# Altium schematic sheet CPU_LPDDR4.SchDoc
size C; SheetNumber: 23; SheetTotal: 25
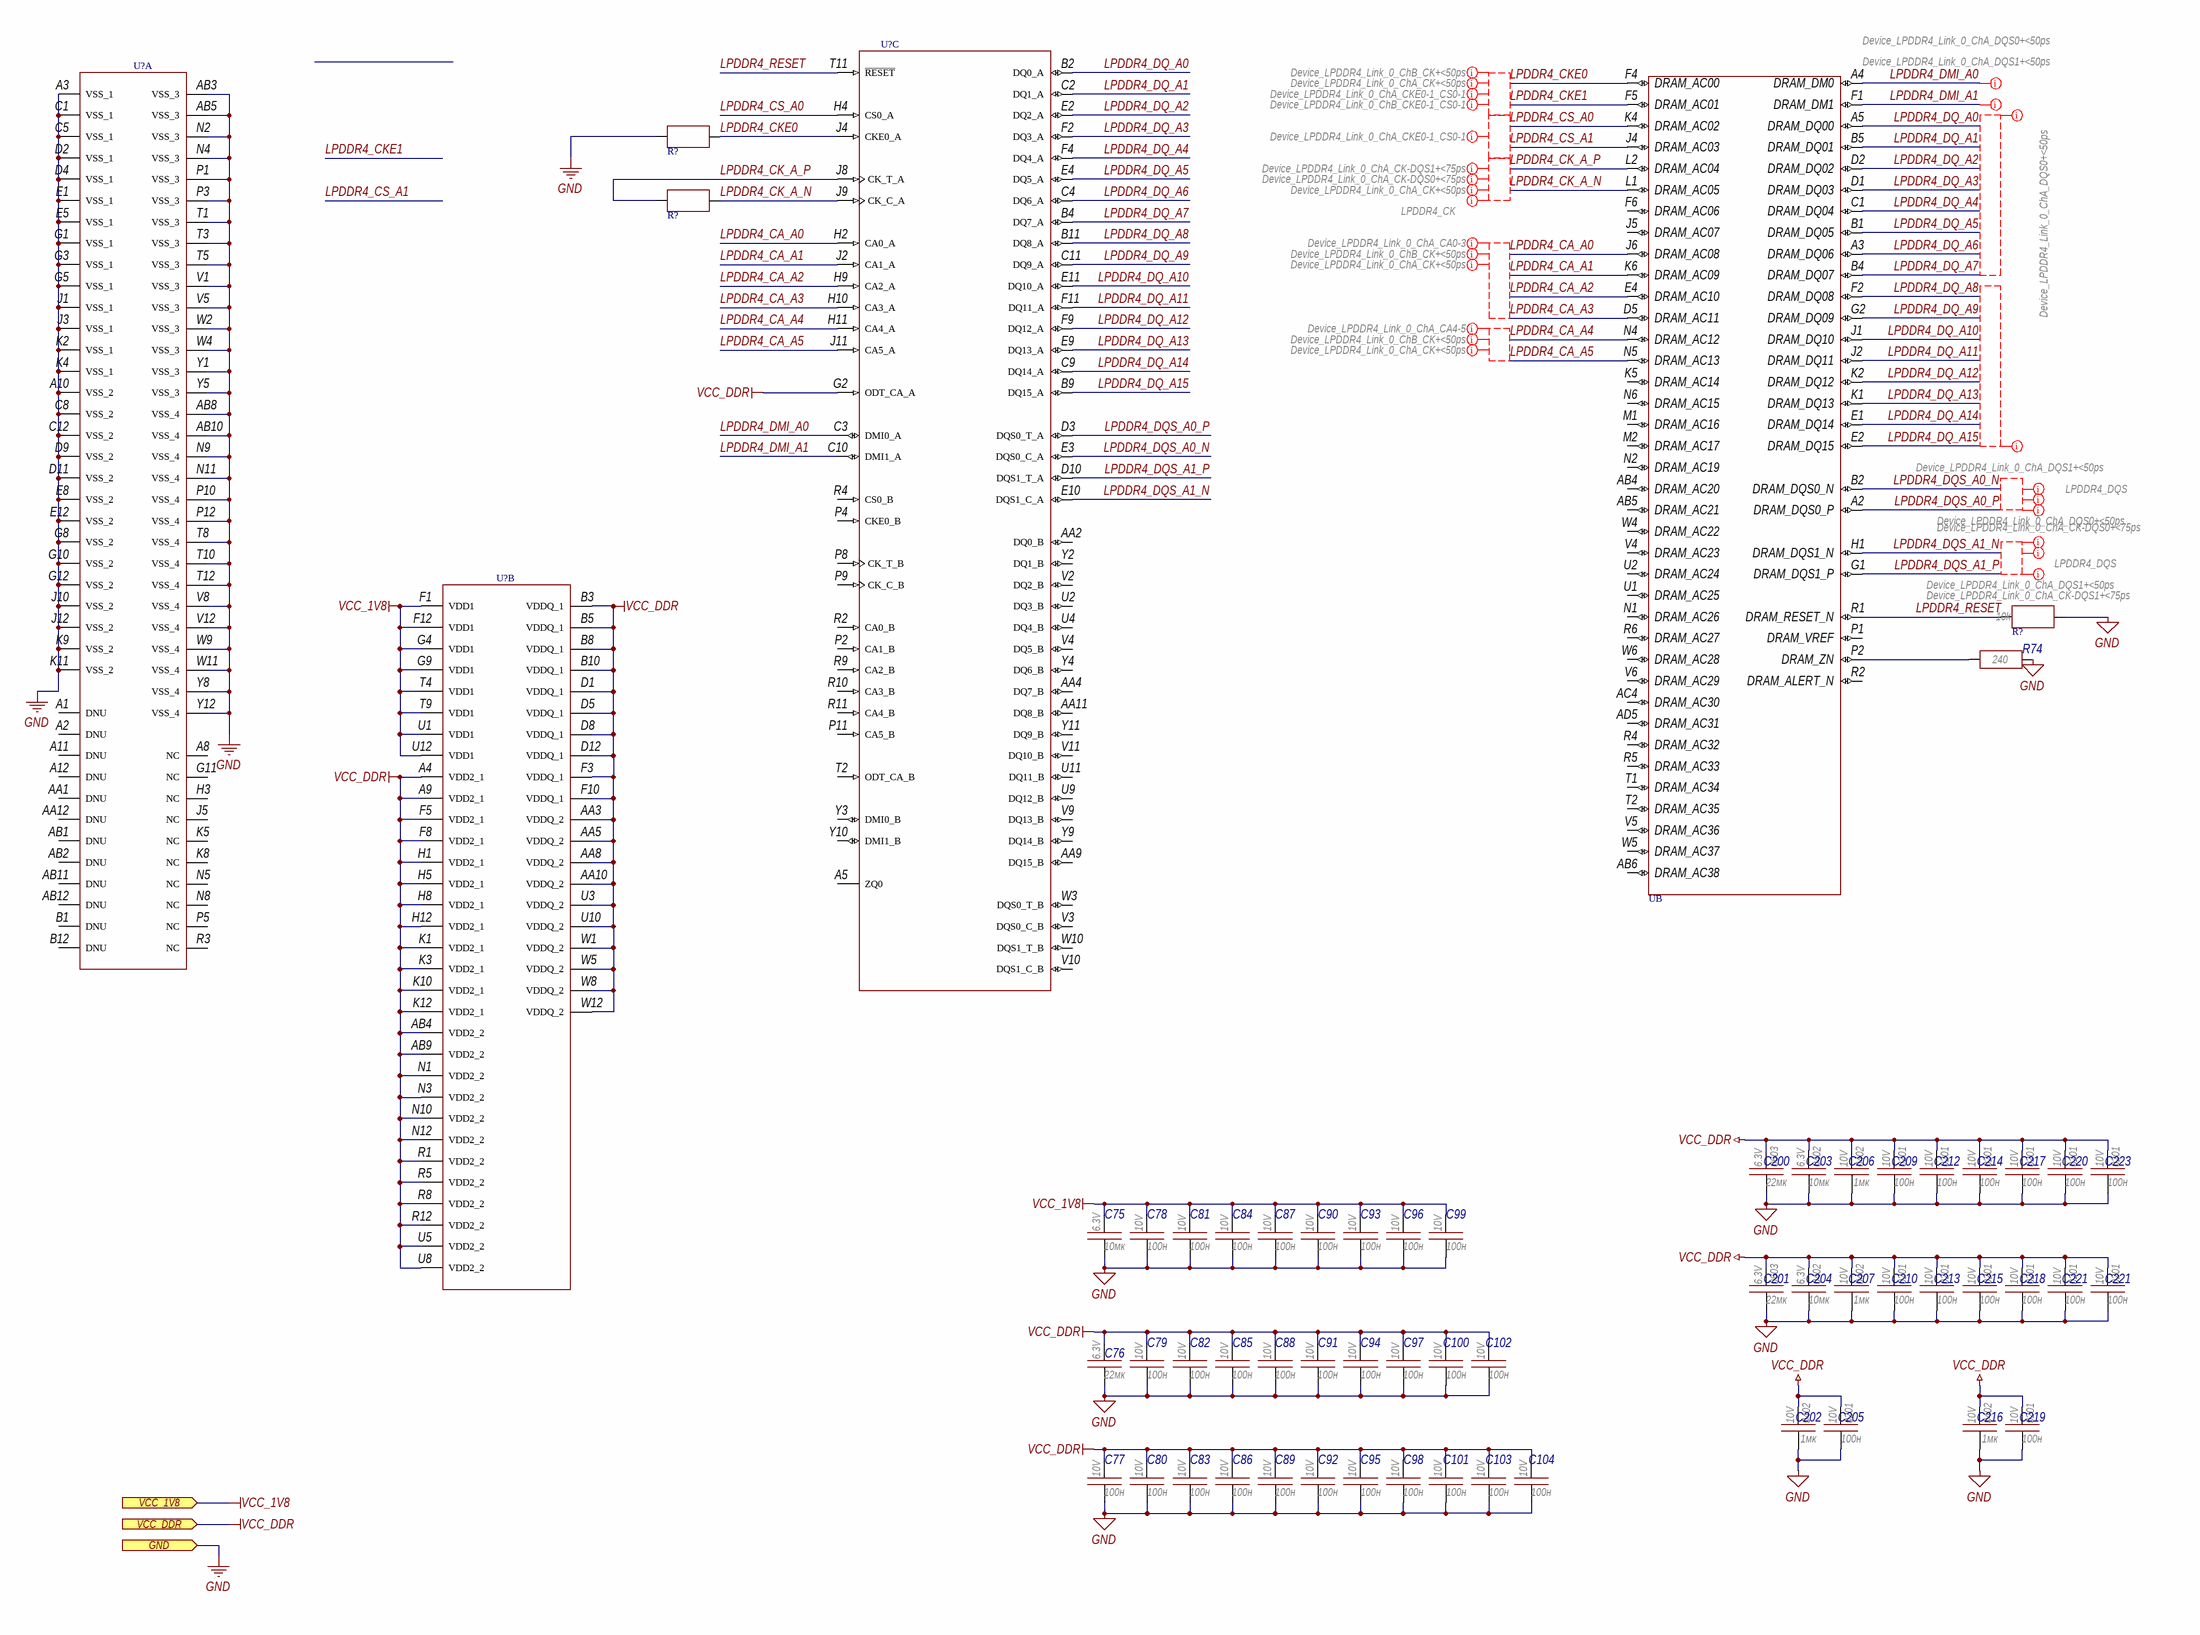
[diagram p0: CPU_LPDDR4.SchDoc]

## Parts
(Parts that share a designator on the sheet are numbered #1, #2 ... from top to bottom, then left to right.)
C75  Значение: 10мк  3) Voltage: 6.3V  [CAPC_1.15x0.65x0.65B_L_Gap-0.25mm]  (hidden comment: GRM155R60J106ME15)
C76  Значение: 22мк  3) Voltage: 6.3V  [CAPC_1.8x1.0x1.0B_L]  (hidden comment: GRM188R60J226MEA0)
C77  Значение: 100н  3) Voltage: 10V  [CAPC_0.63x0.33x0.33B_L_SG-0.25_SE-0.05]  (hidden comment: Capacitor unpolarized)
C78  Значение: 100н  3) Voltage: 10V  [CAPC_0.63x0.33x0.33B_L_SG-0.25_SE-0.05]  (hidden comment: Capacitor unpolarized)
C79  Значение: 100н  3) Voltage: 10V  [CAPC_0.63x0.33x0.33B_L_SG-0.25_SE-0.05]  (hidden comment: Capacitor unpolarized)
C80  Значение: 100н  3) Voltage: 10V  [CAPC_0.63x0.33x0.33B_L_SG-0.25_SE-0.05]  (hidden comment: Capacitor unpolarized)
C81  Значение: 100н  3) Voltage: 10V  [CAPC_0.63x0.33x0.33B_L_SG-0.25_SE-0.05]  (hidden comment: Capacitor unpolarized)
C82  Значение: 100н  3) Voltage: 10V  [CAPC_0.63x0.33x0.33B_L_SG-0.25_SE-0.05]  (hidden comment: Capacitor unpolarized)
C83  Значение: 100н  3) Voltage: 10V  [CAPC_0.63x0.33x0.33B_L_SG-0.25_SE-0.05]  (hidden comment: Capacitor unpolarized)
C84  Значение: 100н  3) Voltage: 10V  [CAPC_0.63x0.33x0.33B_L_SG-0.25_SE-0.05]  (hidden comment: Capacitor unpolarized)
C85  Значение: 100н  3) Voltage: 10V  [CAPC_0.63x0.33x0.33B_L_SG-0.25_SE-0.05]  (hidden comment: Capacitor unpolarized)
C86  Значение: 100н  3) Voltage: 10V  [CAPC_0.63x0.33x0.33B_L_SG-0.25_SE-0.05]  (hidden comment: Capacitor unpolarized)
C87  Значение: 100н  3) Voltage: 10V  [CAPC_0.63x0.33x0.33B_L_SG-0.25_SE-0.05]  (hidden comment: Capacitor unpolarized)
C88  Значение: 100н  3) Voltage: 10V  [CAPC_0.63x0.33x0.33B_L_SG-0.25_SE-0.05]  (hidden comment: Capacitor unpolarized)
C89  Значение: 100н  3) Voltage: 10V  [CAPC_0.63x0.33x0.33B_L_SG-0.25_SE-0.05]  (hidden comment: Capacitor unpolarized)
C90  Значение: 100н  3) Voltage: 10V  [CAPC_0.63x0.33x0.33B_L_SG-0.25_SE-0.05]  (hidden comment: Capacitor unpolarized)
C91  Значение: 100н  3) Voltage: 10V  [CAPC_0.63x0.33x0.33B_L_SG-0.25_SE-0.05]  (hidden comment: Capacitor unpolarized)
C92  Значение: 100н  3) Voltage: 10V  [CAPC_0.63x0.33x0.33B_L_SG-0.25_SE-0.05]  (hidden comment: Capacitor unpolarized)
C93  Значение: 100н  3) Voltage: 10V  [CAPC_0.63x0.33x0.33B_L_SG-0.25_SE-0.05]  (hidden comment: Capacitor unpolarized)
C94  Значение: 100н  3) Voltage: 10V  [CAPC_0.63x0.33x0.33B_L_SG-0.25_SE-0.05]  (hidden comment: Capacitor unpolarized)
C95  Значение: 100н  3) Voltage: 10V  [CAPC_0.63x0.33x0.33B_L_SG-0.25_SE-0.05]  (hidden comment: Capacitor unpolarized)
C96  Значение: 100н  3) Voltage: 10V  [CAPC_0.63x0.33x0.33B_L_SG-0.25_SE-0.05]  (hidden comment: Capacitor unpolarized)
C97  Значение: 100н  3) Voltage: 10V  [CAPC_0.63x0.33x0.33B_L_SG-0.25_SE-0.05]  (hidden comment: Capacitor unpolarized)
C98  Значение: 100н  3) Voltage: 10V  [CAPC_0.63x0.33x0.33B_L_SG-0.25_SE-0.05]  (hidden comment: Capacitor unpolarized)
C99  Значение: 100н  3) Voltage: 10V  [CAPC_0.63x0.33x0.33B_L_SG-0.25_SE-0.05]  (hidden comment: Capacitor unpolarized)
C100  Значение: 100н  3) Voltage: 10V  [CAPC_0.63x0.33x0.33B_L_SG-0.25_SE-0.05]  (hidden comment: Capacitor unpolarized)
C101  Значение: 100н  3) Voltage: 10V  [CAPC_0.63x0.33x0.33B_L_SG-0.25_SE-0.05]  (hidden comment: Capacitor unpolarized)
C102  Значение: 100н  3) Voltage: 10V  [CAPC_0.63x0.33x0.33B_L_SG-0.25_SE-0.05]  (hidden comment: Capacitor unpolarized)
C103  Значение: 100н  3) Voltage: 10V  [CAPC_0.63x0.33x0.33B_L_SG-0.25_SE-0.05]  (hidden comment: Capacitor unpolarized)
C104  Значение: 100н  3) Voltage: 10V  [CAPC_0.63x0.33x0.33B_L_SG-0.25_SE-0.05]  (hidden comment: Capacitor unpolarized)
C200  Значение: 22мк  2) Package: 0603  3) Voltage: 6.3V  [CAPC_1.8x1.0x1.0B_L]  (hidden comment: GRM188R60J226MEA0)
C201  Значение: 22мк  2) Package: 0603  3) Voltage: 6.3V  [CAPC_1.8x1.0x1.0B_L]  (hidden comment: GRM188R60J226MEA0)
C202  Значение: 1мк  2) Package: 0402  3) Voltage: 10V  [CAPC_1.05x0.55x0.55B_N_SG-0.25_SE-0.05]  (hidden comment: GRM155R61A105KE15D)
C203  Значение: 10мк  2) Package: 0402  3) Voltage: 6.3V  [CAPC_1.15x0.65x0.65B_L_Gap-0.25mm]  (hidden comment: GRM155R60J106ME15)
C204  Значение: 10мк  2) Package: 0402  3) Voltage: 6.3V  [CAPC_1.15x0.65x0.65B_L_Gap-0.25mm]  (hidden comment: GRM155R60J106ME15)
C205  Значение: 100н  2) Package: 0201  3) Voltage: 10V  [CAPC_0.63x0.33x0.33B_LL_SG-0.25_SE-0.05]  (hidden comment: GRM033R61A104KE15)
C206  Значение: 1мк  2) Package: 0402  3) Voltage: 10V  [CAPC_1.05x0.55x0.55B_N_SG-0.25_SE-0.05]  (hidden comment: GRM155R61A105KE15D)
C207  Значение: 1мк  2) Package: 0402  3) Voltage: 10V  [CAPC_1.05x0.55x0.55B_N_SG-0.25_SE-0.05]  (hidden comment: GRM155R61A105KE15D)
C209  Значение: 100н  2) Package: 0201  3) Voltage: 10V  [CAPC_0.63x0.33x0.33B_LL_SG-0.25_SE-0.05]  (hidden comment: GRM033R61A104KE15)
C210  Значение: 100н  2) Package: 0201  3) Voltage: 10V  [CAPC_0.63x0.33x0.33B_LL_SG-0.25_SE-0.05]  (hidden comment: GRM033R61A104KE15)
C212  Значение: 100н  2) Package: 0201  3) Voltage: 10V  [CAPC_0.63x0.33x0.33B_LL_SG-0.25_SE-0.05]  (hidden comment: GRM033R61A104KE15)
C213  Значение: 100н  2) Package: 0201  3) Voltage: 10V  [CAPC_0.63x0.33x0.33B_LL_SG-0.25_SE-0.05]  (hidden comment: GRM033R61A104KE15)
C214  Значение: 100н  2) Package: 0201  3) Voltage: 10V  [CAPC_0.63x0.33x0.33B_LL_SG-0.25_SE-0.05]  (hidden comment: GRM033R61A104KE15)
C215  Значение: 100н  2) Package: 0201  3) Voltage: 10V  [CAPC_0.63x0.33x0.33B_LL_SG-0.25_SE-0.05]  (hidden comment: GRM033R61A104KE15)
C216  Значение: 1мк  2) Package: 0402  3) Voltage: 10V  [CAPC_1.05x0.55x0.55B_N_SG-0.25_SE-0.05]  (hidden comment: GRM155R61A105KE15D)
C217  Значение: 100н  2) Package: 0201  3) Voltage: 10V  [CAPC_0.63x0.33x0.33B_LL_SG-0.25_SE-0.05]  (hidden comment: GRM033R61A104KE15)
C218  Значение: 100н  2) Package: 0201  3) Voltage: 10V  [CAPC_0.63x0.33x0.33B_LL_SG-0.25_SE-0.05]  (hidden comment: GRM033R61A104KE15)
C219  Значение: 100н  2) Package: 0201  3) Voltage: 10V  [CAPC_0.63x0.33x0.33B_LL_SG-0.25_SE-0.05]  (hidden comment: GRM033R61A104KE15)
C220  Значение: 100н  2) Package: 0201  3) Voltage: 10V  [CAPC_0.63x0.33x0.33B_LL_SG-0.25_SE-0.05]  (hidden comment: GRM033R61A104KE15)
C221#1  Значение: 100н  2) Package: 0201  3) Voltage: 10V  [CAPC_0.63x0.33x0.33B_LL_SG-0.25_SE-0.05]  (hidden comment: GRM033R61A104KE15)
C221#2  Значение: 100н  2) Package: 0201  3) Voltage: 10V  [CAPC_0.63x0.33x0.33B_LL_SG-0.25_SE-0.05]  (hidden comment: GRM033R61A104KE15)
C223  Значение: 100н  2) Package: 0201  3) Voltage: 10V  [CAPC_0.63x0.33x0.33B_LL_SG-0.25_SE-0.05]  (hidden comment: GRM033R61A104KE15)
R74  Значение: 240  [RESC_1.05x0.55x0.40B_L]  (hidden comment: RC0402FR-07240RL)
R?#1  0R NP  [R0603]  (value not drawn)
R?#2  150R  [R0603]  (value not drawn)
R?#3  10k  [R0603]
U  MIMX8MN6DVTJZAA  [486-BGA-NXP]  (value not drawn)  (part B of 8)
U?#1  MT53E256M32D2DS-046_IT:B  [*IC_MT53E256M32D2DS-046_IT:B_MT53E256M32D2DS-046_IT:B(Primary)]  (value not drawn)  (part C of 3)
U?#2  MT53E256M32D2DS-046_IT:B  [*IC_MT53E256M32D2DS-046_IT:B_MT53E256M32D2DS-046_IT:B(Primary)]  (value not drawn)  (part A of 3)
U?#3  MT53E256M32D2DS-046_IT:B  [*IC_MT53E256M32D2DS-046_IT:B_MT53E256M32D2DS-046_IT:B(Primary)]  (value not drawn)  (part B of 3)

## Ports
GND (in), VCC_1V8 (in), VCC_DDR (in)

## Nets
GND: C75.2 C76.2 C77.2 C78.2 C79.2 C80.2 C81.2 C82.2 C83.2 C84.2 C85.2 C86.2 C87.2 C88.2 C89.2 C90.2 C91.2 C92.2 C93.2 C94.2 C95.2 C96.2 C97.2 C98.2 C99.2 C100.2 C101.2 C102.2 C103.2 C104.2 C200.2 C201.2 C202.2 C203.2 C204.2 C205.2 C206.2 C207.2 C209.2 C210.2 C212.2 C213.2 C214.2 C215.2 C216.2 C217.2 C218.2 C219.2 C220.2 C221#1.2 C221#2.2 C223.2 R74.2 R?#1.1 R?#3.2 U?#2.A3(VSS_1) U?#2.A10(VSS_2) U?#2.AB3(VSS_3) U?#2.AB5(VSS_3) U?#2.AB8(VSS_4) U?#2.AB10(VSS_4) U?#2.C1(VSS_1) U?#2.C5(VSS_1) U?#2.C8(VSS_2) U?#2.C12(VSS_2) U?#2.D2(VSS_1) U?#2.D4(VSS_1) U?#2.D9(VSS_2) U?#2.D11(VSS_2) U?#2.E1(VSS_1) U?#2.E5(VSS_1) U?#2.E8(VSS_2) U?#2.E12(VSS_2) U?#2.G1(VSS_1) U?#2.G3(VSS_1) U?#2.G5(VSS_1) U?#2.G8(VSS_2) U?#2.G10(VSS_2) U?#2.G12(VSS_2) U?#2.J1(VSS_1) U?#2.J3(VSS_1) U?#2.J10(VSS_2) U?#2.J12(VSS_2) U?#2.K2(VSS_1) U?#2.K4(VSS_1) U?#2.K9(VSS_2) U?#2.K11(VSS_2) U?#2.N2(VSS_3) U?#2.N4(VSS_3) U?#2.N9(VSS_4) U?#2.N11(VSS_4) U?#2.P1(VSS_3) U?#2.P3(VSS_3) U?#2.P10(VSS_4) U?#2.P12(VSS_4) U?#2.T1(VSS_3) U?#2.T3(VSS_3) U?#2.T5(VSS_3) U?#2.T8(VSS_4) U?#2.T10(VSS_4) U?#2.T12(VSS_4) U?#2.V1(VSS_3) U?#2.V5(VSS_3) U?#2.V8(VSS_4) U?#2.V12(VSS_4) U?#2.W2(VSS_3) U?#2.W4(VSS_3) U?#2.W9(VSS_4) U?#2.W11(VSS_4) U?#2.Y1(VSS_3) U?#2.Y5(VSS_3) U?#2.Y8(VSS_4) U?#2.Y12(VSS_4) ; port GND
VCC_1V8: C75.1 C78.1 C81.1 C84.1 C87.1 C90.1 C93.1 C96.1 C99.1 U?#3.F1(VDD1) U?#3.F12(VDD1) U?#3.G4(VDD1) U?#3.G9(VDD1) U?#3.T4(VDD1) U?#3.T9(VDD1) U?#3.U1(VDD1) U?#3.U12(VDD1) ; port VCC_1V8
VCC_DDR: C76.1 C77.1 C79.1 C80.1 C82.1 C83.1 C85.1 C86.1 C88.1 C89.1 C91.1 C92.1 C94.1 C95.1 C97.1 C98.1 C100.1 C101.1 C102.1 C103.1 C104.1 C200.1 C201.1 C202.1 C203.1 C204.1 C205.1 C206.1 C207.1 C209.1 C210.1 C212.1 C213.1 C214.1 C215.1 C216.1 C217.1 C218.1 C219.1 C220.1 C221#1.1 C221#2.1 C223.1 U?#1.G2(ODT_CA_A) U?#3.A4(VDD2_1) U?#3.A9(VDD2_1) U?#3.AA3(VDDQ_2) U?#3.AA5(VDDQ_2) U?#3.AA8(VDDQ_2) U?#3.AA10(VDDQ_2) U?#3.AB4(VDD2_2) U?#3.AB9(VDD2_2) U?#3.B3(VDDQ_1) U?#3.B5(VDDQ_1) U?#3.B8(VDDQ_1) U?#3.B10(VDDQ_1) U?#3.D1(VDDQ_1) U?#3.D5(VDDQ_1) U?#3.D8(VDDQ_1) U?#3.D12(VDDQ_1) U?#3.F3(VDDQ_1) U?#3.F5(VDD2_1) U?#3.F8(VDD2_1) U?#3.F10(VDDQ_1) U?#3.H1(VDD2_1) U?#3.H5(VDD2_1) U?#3.H8(VDD2_1) U?#3.H12(VDD2_1) U?#3.K1(VDD2_1) U?#3.K3(VDD2_1) U?#3.K10(VDD2_1) U?#3.K12(VDD2_1) U?#3.N1(VDD2_2) U?#3.N3(VDD2_2) U?#3.N10(VDD2_2) U?#3.N12(VDD2_2) U?#3.R1(VDD2_2) U?#3.R5(VDD2_2) U?#3.R8(VDD2_2) U?#3.R12(VDD2_2) U?#3.U3(VDDQ_2) U?#3.U5(VDD2_2) U?#3.U8(VDD2_2) U?#3.U10(VDDQ_2) U?#3.W1(VDDQ_2) U?#3.W5(VDDQ_2) U?#3.W8(VDDQ_2) U?#3.W12(VDDQ_2) ; port VCC_DDR
LPDDR4_CA_A0: U.J6(DRAM_AC08) U?#1.H2(CA0_A)
LPDDR4_CA_A1: U.K6(DRAM_AC09) U?#1.J2(CA1_A)
LPDDR4_CA_A2: U.E4(DRAM_AC10) U?#1.H9(CA2_A)
LPDDR4_CA_A3: U.D5(DRAM_AC11) U?#1.H10(CA3_A)
LPDDR4_CA_A4: U.N4(DRAM_AC12) U?#1.H11(CA4_A)
LPDDR4_CA_A5: U.N5(DRAM_AC13) U?#1.J11(CA5_A)
LPDDR4_CK_A_N: R?#2.2 U.L1(DRAM_AC05) U?#1.J9(CK_C_A)
LPDDR4_CK_A_P: R?#2.1 U.L2(DRAM_AC04) U?#1.J8(CK_T_A)
LPDDR4_CKE0: R?#1.2 U.F4(DRAM_AC00) U?#1.J4(CKE0_A)
LPDDR4_CKE1: U.F5(DRAM_AC01)
LPDDR4_CS_A0: U.K4(DRAM_AC02) U?#1.H4(CS0_A)
LPDDR4_CS_A1: U.J4(DRAM_AC03)
LPDDR4_DMI_A0: U.A4(DRAM_DM0) U?#1.C3(DMI0_A)
LPDDR4_DMI_A1: U.F1(DRAM_DM1) U?#1.C10(DMI1_A)
LPDDR4_DQ_A0: U.A5(DRAM_DQ00) U?#1.B2(DQ0_A)
LPDDR4_DQ_A1: U.B5(DRAM_DQ01) U?#1.C2(DQ1_A)
LPDDR4_DQ_A2: U.D2(DRAM_DQ02) U?#1.E2(DQ2_A)
LPDDR4_DQ_A3: U.D1(DRAM_DQ03) U?#1.F2(DQ3_A)
LPDDR4_DQ_A4: U.C1(DRAM_DQ04) U?#1.F4(DQ4_A)
LPDDR4_DQ_A5: U.B1(DRAM_DQ05) U?#1.E4(DQ5_A)
LPDDR4_DQ_A6: U.A3(DRAM_DQ06) U?#1.C4(DQ6_A)
LPDDR4_DQ_A7: U.B4(DRAM_DQ07) U?#1.B4(DQ7_A)
LPDDR4_DQ_A8: U.F2(DRAM_DQ08) U?#1.B11(DQ8_A)
LPDDR4_DQ_A9: U.G2(DRAM_DQ09) U?#1.C11(DQ9_A)
LPDDR4_DQ_A10: U.J1(DRAM_DQ10) U?#1.E11(DQ10_A)
LPDDR4_DQ_A11: U.J2(DRAM_DQ11) U?#1.F11(DQ11_A)
LPDDR4_DQ_A12: U.K2(DRAM_DQ12) U?#1.F9(DQ12_A)
LPDDR4_DQ_A13: U.K1(DRAM_DQ13) U?#1.E9(DQ13_A)
LPDDR4_DQ_A14: U.E1(DRAM_DQ14) U?#1.C9(DQ14_A)
LPDDR4_DQ_A15: U.E2(DRAM_DQ15) U?#1.B9(DQ15_A)
LPDDR4_DQS_A0_N: U.B2(DRAM_DQS0_N) U?#1.E3(DQS0_C_A)
LPDDR4_DQS_A0_P: U.A2(DRAM_DQS0_P) U?#1.D3(DQS0_T_A)
LPDDR4_DQS_A1_N: U.H1(DRAM_DQS1_N) U?#1.E10(DQS1_C_A)
LPDDR4_DQS_A1_P: U.G1(DRAM_DQS1_P) U?#1.D10(DQS1_T_A)
LPDDR4_RESET: R?#3.1 U.R1(DRAM_RESET_N) U?#1.T11(~{RESET})
NetR74_1: R74.1 U.P2(DRAM_ZN)

Not connected (* = marked no-connect by the designer): U AB4(DRAM_AC20) AB5(DRAM_AC21) AB6(DRAM_AC38) AC4(DRAM_AC30) AD5(DRAM_AC31) F6(DRAM_AC06) J5(DRAM_AC07) K5(DRAM_AC14) M1(DRAM_AC16) M2(DRAM_AC17) N1(DRAM_AC26) N2(DRAM_AC19) N6(DRAM_AC15) P1(DRAM_VREF) R2(DRAM_ALERT_N) R4(DRAM_AC32) R5(DRAM_AC33) R6(DRAM_AC27) T1(DRAM_AC34) T2(DRAM_AC35) U1(DRAM_AC25) U2(DRAM_AC24) V4(DRAM_AC23) V5(DRAM_AC36) V6(DRAM_AC29) W4(DRAM_AC22) W5(DRAM_AC37) W6(DRAM_AC28); U?#1 A5(ZQ0) AA2(DQ0_B) AA4(DQ7_B) AA9(DQ15_B) AA11(DQ8_B) P2(CA1_B) P4(CKE0_B) P8(CK_T_B) P9(CK_C_B) P11(CA5_B) R2(CA0_B) R4(CS0_B) R9(CA2_B) R10(CA3_B) R11(CA4_B) T2(ODT_CA_B) U2(DQ3_B) U4(DQ4_B) U9(DQ12_B) U11(DQ11_B) V2(DQ2_B) V3(DQS0_C_B) V4(DQ5_B) V9(DQ13_B) V10(DQS1_C_B) V11(DQ10_B) W3(DQS0_T_B) W10(DQS1_T_B) Y2(DQ1_B) Y3(DMI0_B) Y4(DQ6_B) Y9(DQ14_B) Y10(DMI1_B) Y11(DQ9_B); U?#2 A1(DNU) A2(DNU) A8(NC) A11(DNU) A12(DNU) AA1(DNU) AA12(DNU) AB1(DNU) AB2(DNU) AB11(DNU) AB12(DNU) B1(DNU) B12(DNU) G11(NC) H3(NC) J5(NC) K5(NC) K8(NC) N5(NC) N8(NC) P5(NC) R3(NC)

## Layout directives
net class Device_LPDDR4_Link_0_ChA_DQS0+<50ps: LPDDR4_DMI_A0, LPDDR4_DQ_A0, LPDDR4_DQ_A1, LPDDR4_DQ_A2, LPDDR4_DQ_A3, LPDDR4_DQ_A4, LPDDR4_DQ_A5, LPDDR4_DQ_A6, LPDDR4_DQ_A7, LPDDR4_DQS_A0_N, LPDDR4_DQS_A0_P
net class Device_LPDDR4_Link_0_ChA_DQS1+<50ps: LPDDR4_DMI_A1, LPDDR4_DQ_A8, LPDDR4_DQ_A9, LPDDR4_DQ_A10, LPDDR4_DQ_A11, LPDDR4_DQ_A12, LPDDR4_DQ_A13, LPDDR4_DQ_A14, LPDDR4_DQ_A15, LPDDR4_DQS_A1_N, LPDDR4_DQS_A1_P
net class Device_LPDDR4_Link_0_ChA_CK-DQS1+<75ps: LPDDR4_CK_A_N, LPDDR4_CK_A_P, LPDDR4_DQS_A1_N, LPDDR4_DQS_A1_P
net class Device_LPDDR4_Link_0_ChA_CK-DQS0+<75ps: LPDDR4_CK_A_N, LPDDR4_CK_A_P, LPDDR4_DQS_A0_N, LPDDR4_DQS_A0_P
differential pair; differential pair class LPDDR4_DQS: LPDDR4_DQS_A0_N, LPDDR4_DQS_A0_P, LPDDR4_DQS_A1_N, LPDDR4_DQS_A1_P
differential pair; differential pair class LPDDR4_CK: LPDDR4_CK_A_N, LPDDR4_CK_A_P
net class Device_LPDDR4_Link_0_ChA_CKE0-1_CS0-1; rule Matched Net Lengths [Delay Tolerance = 2ps]: LPDDR4_CKE0, LPDDR4_CKE1, LPDDR4_CS_A0, LPDDR4_CS_A1
net class Device_LPDDR4_Link_0_ChA_CK+<50ps: LPDDR4_CA_A0, LPDDR4_CA_A1, LPDDR4_CA_A2, LPDDR4_CA_A3, LPDDR4_CA_A4, LPDDR4_CA_A5, LPDDR4_CK_A_N, LPDDR4_CK_A_P, LPDDR4_CKE0, LPDDR4_CKE1
net class Device_LPDDR4_Link_0_ChB_CK+<50ps: LPDDR4_CA_A0, LPDDR4_CA_A1, LPDDR4_CA_A2, LPDDR4_CA_A3, LPDDR4_CA_A4, LPDDR4_CA_A5, LPDDR4_CKE0, LPDDR4_CKE1
net class Device_LPDDR4_Link_0_ChB_CKE0-1_CS0-1; rule Matched Net Lengths [Delay Tolerance = 2ps]: LPDDR4_CKE0, LPDDR4_CKE1
net class Device_LPDDR4_Link_0_ChA_CA4-5; rule Matched Net Lengths [Delay Tolerance = 2ps]: LPDDR4_CA_A4, LPDDR4_CA_A5
net class Device_LPDDR4_Link_0_ChA_CA0-3; rule Matched Net Lengths [Delay Tolerance = 2ps]: LPDDR4_CA_A0, LPDDR4_CA_A1, LPDDR4_CA_A2, LPDDR4_CA_A3

## Notes on the sheet
- Подп. дата
- Инв. № дубл.
- Взам. инв. №
- Подп. и дата
- Инв. № подл.
- Изм.
- Лист
- № докум.
- Подп.
- Дата
- ALTIUM GOSTBOM2.0 KEV
- Файл:
- Копировал
- Формат А3

## Library data of the parts
C75 = VCH_CMP_CAP_0000551-15: N/A; Manufacturer: Murata; Value: 10µF; 2) Package: 0402; 1) Ta max: 85°C; 1) Ta min: -55°C; 2) Height max: 650µm; 2) Length max: 1.15mm; 4) Dielectric: X5R; 4) Note: Derating1。 Only for mobile devices; 3) Tolerance [%]: 20%; 5) Application: General Purpose; Part Number: GRM155R60J106ME15; 2) Width max: 650µm
C76 = VCH_CMP_CAP_0000712-11: N/A; Manufacturer: Murata; Value: 22µF; 2) Package: 0603; 1) Ta max: 85°C; 1) Ta min: -55°C; 2) Height max: 1mm; 2) Length max: 1.8mm; 4) Dielectric: X5R; 4) Note: Derating1; 3) Tolerance [%]: 20%; 5) Application: General Purpose; Part Number: GRM188R60J226MEA0; 2) Width max: 1mm
C77-C104 = VCH_CMP_CAP_0000132-14: N/A; Part Number: GRM033R61A104KE15; Manufacturer: Murata; Value: 100nF; 2) Package: 0201; 1) Ta max: 85°C; 1) Ta min: -55°C; 2) Height max: 330µm; 2) Length max: 630µm; 4) Dielectric: X5R; 3) Tolerance [%]: 10%; 5) Application: General Purpose; 2) Width max: 330µm; 4) Note: N/A
C200 C201 = VCH_CMP_CAP_0000712-11: N/A; Manufacturer: Murata; Value: 22µF; 1) Ta max: 85°C; 1) Ta min: -55°C; 2) Height max: 1mm; 2) Length max: 1.8mm; 4) Dielectric: X5R; 4) Note: Derating1; 3) Tolerance [%]: 20%; 5) Application: General Purpose; Part Number: GRM188R60J226MEA0; 2) Width max: 1mm
C202 C206 C207 C216 = VCH_CMP_CAP_0000895-13: N/A; Manufacturer: Murata; Value: 1µF; 1) Ta max: 85°C; 1) Ta min: -55°C; 2) Height max: 550µm; 2) Length max: 1.05mm; 4) Dielectric: X5R; 3) Tolerance [%]: 10%; 5) Application: General Purpose; Part Number: GRM155R61A105KE15D; 2) Width max: 550µm; 4) Note: N/A
C203 C204 = VCH_CMP_CAP_0000551-15: N/A; Manufacturer: Murata; Value: 10µF; 1) Ta max: 85°C; 1) Ta min: -55°C; 2) Height max: 650µm; 2) Length max: 1.15mm; 4) Dielectric: X5R; 4) Note: Derating1。 Only for mobile devices; 3) Tolerance [%]: 20%; 5) Application: General Purpose; Part Number: GRM155R60J106ME15; 2) Width max: 650µm
C205 C209 C210 C212-C215 C217-C220 C221#1 C221#2 C223 = VCH_CMP_CAP_0000132-25: N/A; Manufacturer: Murata; Value: 100nF; 1) Ta max: 85°C; 1) Ta min: -55°C; 2) Height max: 330µm; 2) Length max: 630µm; 4) Dielectric: X5R; 3) Tolerance [%]: 10%; 5) Application: General Purpose; Part Number: GRM033R61A104KE15; 2) Width max: 330µm; 4) Note: N/A
R74 = VCH_CMP_RES_0000072-51: N/A; Manufacturer: Yageo; 2) Package: 0402; Value: 240; 1) Ta max: 155°C; 1) Ta min: -55°C; 2) Height max: 400µm; 2) Length max: 1.05mm; 2) Width max: 550µm; 3) Io: 2A; 3) Ir: 1A; 3) Power: 63mW; 3) Tolerance: 1%; 3) Vo max: 100V; 3) Vw max: 50V; Part Number: RC0402FR-07240RL
R?#1 = Res 0R NP 1% 0603: Tolerance: 1%; Case: 0603; Value: 0R NP
R?#2 = Res 150R 1% 0603: Part Number: RC0603FR-07150RL; Manufacture: Yageo; Tolerance: 1%; Case: 0603; Value: 150R; Model: RC0603FR-07150RL
R?#3 = Res 10k 1% 0603: Part Number: P10.0KHTR-ND; Manufacture: Panasonic Electronic Components; Tolerance: 1%; Model: ERJ-3EKF1002V; HelpURL: https://www.digikey.com/en/products/detail/ERJ-3EKF1002V/P10.0KHCT-ND/198102; Case: 0603; Value: 10k
U = MIMX8MN6DVTJZAA: ARMÂ® CortexÂ®-A53 Microprocessor IC i.MX8MN 4 Core, 32-Bit 1.5GHz 486-LFBGA (14x14); Manufacture: NXP USA Inc.; Package: LFBGA-486 NXP USA Inc.; Mouser-Purchase-URL: https://snapeda.com/shop?store=Mouser&id=4467530; Availability: Warning; MP: MIMX8MN6DVTJZAA; SnapEDA_Link: https://www.snapeda.com/parts/MIMX8MN6DVTJZAA/NXP%20Semiconductors/view-part/4467530/?ref=snap; Value: *; Arrow_Electronics-Purchase-URL: https://snapeda.com/shop?store=Arrow+Electronics&id=4467530; BuyPart: https://www.snapeda.com/parts/MIMX8MN6DVTJZAA/NXP%20Semiconductors/view-part/4467530/?ref=eda
U?#1-U?#3 = MT53E256M32D2DS-046_IT:B: Manufacture: Micron; Case: BGA 200; Model: MT53E256M32D2DS-046_IT:B